# Altium schematic sheet STM32H7_PART_3.SchDoc
size A; Organization: Altium Limited; Address1: L3, 12a Rodborough Rd; Address2: Frenchs Forest; Address3: NSW; Address4: Australia 2086
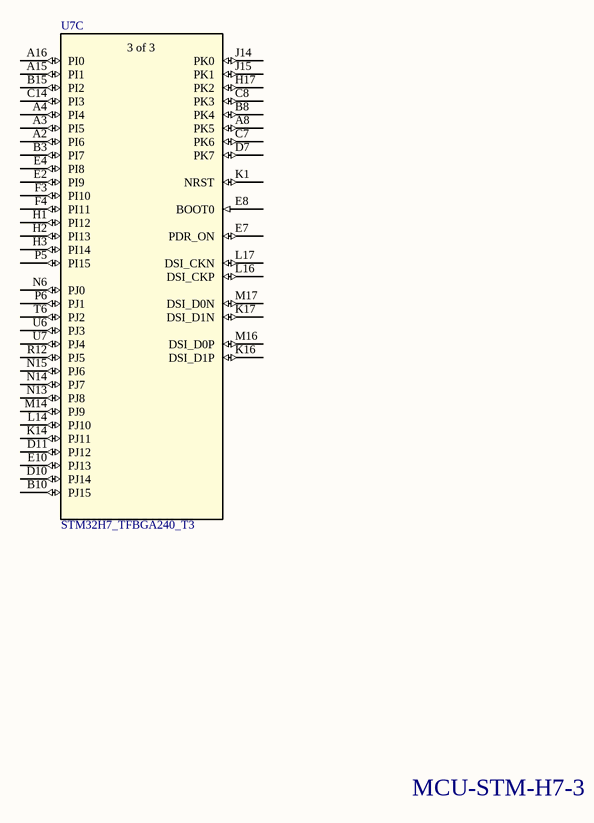
[diagram p0: STM32H7_PART_3.SchDoc]

## Parts
U7  STM32H7_TFBGA240_T3  [TFBGA240+25]  (part C of 4)

## Nets

Not connected (* = marked no-connect by the designer): U7 A2(PI6) A3(PI5) A4(PI4) A8(PK5) A15(PI1) A16(PI0) B3(PI7) B8(PK4) B10(PJ15) B15(PI2) C7(PK6) C8(PK3) C14(PI3) D7(PK7) D10(PJ14) D11(PJ12) E2(PI9) E4(PI8) E7(PDR_ON) E8(BOOT0) E10(PJ13) F3(PI10) F4(PI11) H1(PI12) H2(PI13) H3(PI14) H17(PK2) J14(PK0) J15(PK1) K1(NRST) K14(PJ11) K16(DSI_D1P) K17(DSI_D1N) L14(PJ10) L16(DSI_CKP) L17(DSI_CKN) M14(PJ9) M16(DSI_D0P) M17(DSI_D0N) N6(PJ0) N13(PJ8) N14(PJ7) N15(PJ6) P5(PI15) P6(PJ1) R12(PJ5) T6(PJ2) U6(PJ3) U7(PJ4)

## Notes on the sheet
- MCU-STM-H7-3
- Title
- Size:
- Date:
- A
- Number:
- Time:
- Revision:
- Sheet
- of
- File:
- (in symbol STM32H7_TFBGA240, part C) 3 of 3

## Library data of the parts
U7 = STM32H7_TFBGA240: No Description Available; Vendor: STMicroelectronics; Copyright: Copyright (C) 2018 Accelerated Designs. All rights reserved; Manufacturer_Part_Number: STM32H7_TFBGA240_T3; RefDes: RefDes; Type: DEV